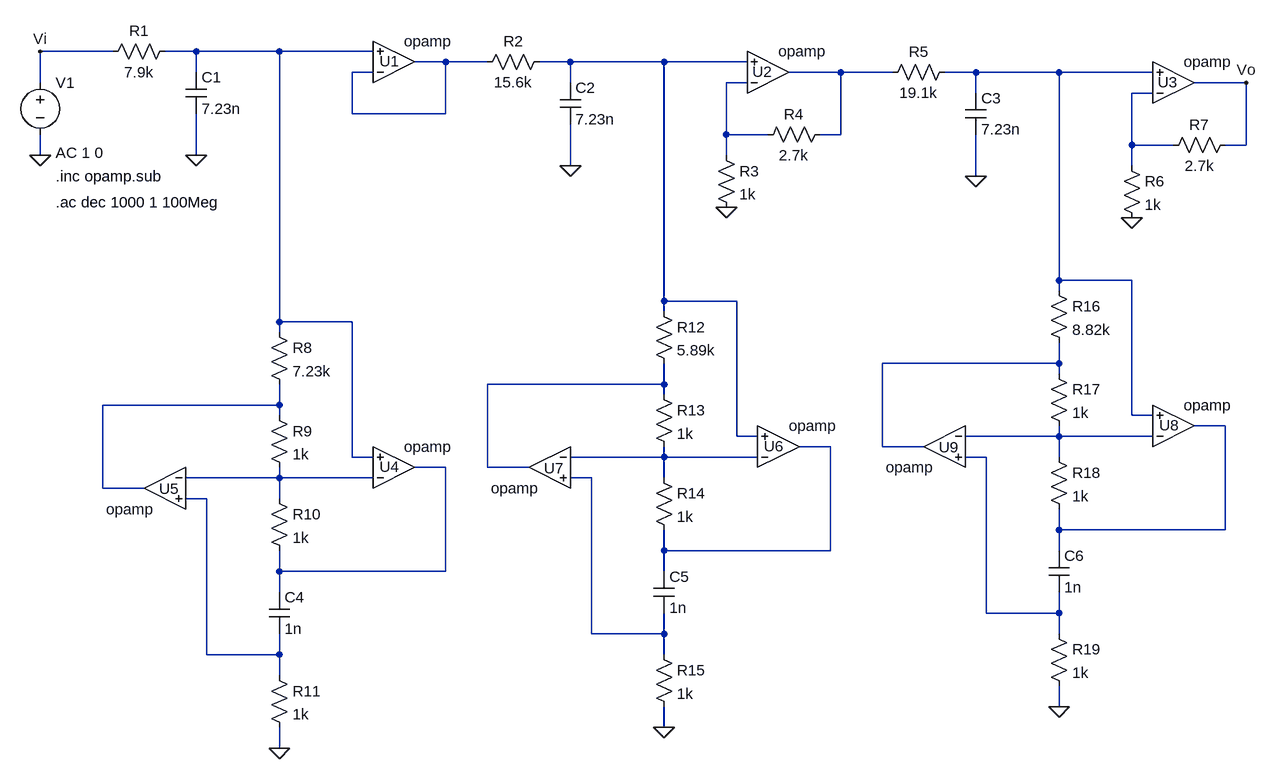
[diagram p0: schematic Circuito2.asc]
Circuito2.asc, the LTspice schematic file:
Version 4
SHEET 1 1728 1188
WIRE -48 80 -160 80
WIRE 80 80 32 80
WIRE 208 80 80 80
WIRE 352 80 208 80
WIRE 464 96 416 96
WIRE 528 96 464 96
WIRE 656 96 608 96
WIRE 800 96 656 96
WIRE 928 96 800 96
WIRE 80 112 80 80
WIRE 352 112 320 112
WIRE 1072 112 992 112
WIRE 1152 112 1072 112
WIRE 1280 112 1232 112
WIRE 1408 112 1280 112
WIRE 1552 112 1408 112
WIRE -160 128 -160 80
WIRE 656 128 656 96
WIRE 928 128 896 128
WIRE 1696 128 1616 128
WIRE 1280 144 1280 112
WIRE 1552 144 1520 144
WIRE 320 176 320 112
WIRE 464 176 464 96
WIRE 464 176 320 176
WIRE 896 208 896 128
WIRE 960 208 896 208
WIRE 1072 208 1072 112
WIRE 1072 208 1040 208
WIRE 1520 224 1520 144
WIRE 1584 224 1520 224
WIRE 1696 224 1696 128
WIRE 1696 224 1664 224
WIRE -160 240 -160 208
WIRE 80 240 80 176
WIRE 896 240 896 208
WIRE 656 256 656 192
WIRE 1520 256 1520 224
WIRE 1280 272 1280 208
WIRE 1408 432 1408 112
WIRE 1520 432 1408 432
WIRE 1408 448 1408 432
WIRE 800 464 800 96
WIRE 912 464 800 464
WIRE 800 480 800 464
WIRE 208 496 208 80
WIRE 320 496 208 496
WIRE 208 512 208 496
WIRE 1408 560 1408 528
WIRE 1408 560 1136 560
WIRE 1408 576 1408 560
WIRE 800 592 800 560
WIRE 800 592 528 592
WIRE 800 608 800 592
WIRE 208 624 208 592
WIRE 208 624 -64 624
WIRE 208 640 208 624
WIRE 1520 640 1520 432
WIRE 1552 640 1520 640
WIRE 1664 656 1616 656
WIRE 912 672 912 464
WIRE 944 672 912 672
WIRE 1408 672 1408 656
WIRE 1408 672 1264 672
WIRE 1552 672 1408 672
WIRE 1056 688 1008 688
WIRE 1136 688 1136 560
WIRE 1200 688 1136 688
WIRE 320 704 320 496
WIRE 352 704 320 704
WIRE 800 704 800 688
WIRE 800 704 656 704
WIRE 944 704 800 704
WIRE 1296 704 1264 704
WIRE 1408 704 1408 672
WIRE 464 720 416 720
WIRE 528 720 528 592
WIRE 592 720 528 720
WIRE 208 736 208 720
WIRE 208 736 64 736
WIRE 352 736 208 736
WIRE 688 736 656 736
WIRE 800 736 800 704
WIRE -64 752 -64 624
WIRE 0 752 -64 752
WIRE 96 768 64 768
WIRE 208 768 208 736
WIRE 1408 816 1408 784
WIRE 1664 816 1664 656
WIRE 1664 816 1408 816
WIRE 800 848 800 816
WIRE 1056 848 1056 688
WIRE 1056 848 800 848
WIRE 1408 848 1408 816
WIRE 208 880 208 848
WIRE 464 880 464 720
WIRE 464 880 208 880
WIRE 800 880 800 848
WIRE 208 912 208 880
WIRE 1296 944 1296 704
WIRE 1408 944 1408 912
WIRE 1408 944 1296 944
WIRE 688 976 688 736
WIRE 800 976 800 944
WIRE 800 976 688 976
WIRE 1408 976 1408 944
WIRE 96 1008 96 768
WIRE 208 1008 208 976
WIRE 208 1008 96 1008
WIRE 800 1008 800 976
WIRE 208 1040 208 1008
WIRE 1408 1088 1408 1056
WIRE 800 1120 800 1088
WIRE 208 1152 208 1120
FLAG 80 240 0
FLAG 656 256 0
FLAG 896 320 0
FLAG 1280 272 0
FLAG 1520 336 0
FLAG 1696 128 Vo
FLAG -160 240 0
FLAG -160 80 Vi
FLAG 208 1152 0
FLAG 800 1120 0
FLAG 1408 1088 0
SYMBOL cap 64 112 R0
SYMATTR InstName C1
SYMATTR Value 7.23n
SYMBOL res 48 64 R90
WINDOW 0 0 56 VBottom 2
WINDOW 3 32 56 VTop 2
SYMATTR InstName R1
SYMATTR Value 7.9k
SYMBOL OpAmps\\opamp 384 160 M180
WINDOW 0 -22 65 Left 2
SYMATTR InstName U1
SYMBOL cap 640 128 R0
SYMATTR InstName C2
SYMATTR Value 7.23n
SYMBOL res 624 80 R90
WINDOW 0 0 56 VBottom 2
WINDOW 3 32 56 VTop 2
SYMATTR InstName R2
SYMATTR Value 15.6k
SYMBOL OpAmps\\opamp 960 176 M180
WINDOW 0 -24 65 Left 2
SYMATTR InstName U2
SYMBOL res 880 224 R0
SYMATTR InstName R3
SYMATTR Value 1k
SYMBOL res 1056 192 R90
WINDOW 0 0 56 VBottom 2
WINDOW 3 32 56 VTop 2
SYMATTR InstName R4
SYMATTR Value 2.7k
SYMBOL cap 1264 144 R0
SYMATTR InstName C3
SYMATTR Value 7.23n
SYMBOL res 1248 96 R90
WINDOW 0 0 56 VBottom 2
WINDOW 3 32 56 VTop 2
SYMATTR InstName R5
SYMATTR Value 19.1k
SYMBOL OpAmps\\opamp 1584 192 M180
WINDOW 0 -24 65 Left 2
SYMATTR InstName U3
SYMBOL res 1504 240 R0
SYMATTR InstName R6
SYMATTR Value 1k
SYMBOL res 1680 208 R90
WINDOW 0 0 56 VBottom 2
WINDOW 3 32 56 VTop 2
SYMATTR InstName R7
SYMATTR Value 2.7k
SYMBOL voltage -160 112 R0
WINDOW 123 24 124 Left 2
WINDOW 39 0 0 Left 0
SYMATTR Value2 AC 1 0
SYMATTR InstName V1
SYMATTR Value ""
SYMBOL res 192 496 R0
SYMATTR InstName R8
SYMATTR Value 7.23k
SYMBOL res 192 624 R0
SYMATTR InstName R9
SYMATTR Value 1k
SYMBOL res 192 752 R0
SYMATTR InstName R10
SYMATTR Value 1k
SYMBOL cap 192 912 R0
SYMATTR InstName C4
SYMATTR Value 1n
SYMBOL res 192 1024 R0
SYMATTR InstName R11
SYMATTR Value 1k
SYMBOL OpAmps\\opamp 384 784 M180
WINDOW 0 -22 65 Left 2
SYMATTR InstName U4
SYMBOL OpAmps\\opamp 32 688 M0
WINDOW 0 -22 65 Left 2
SYMATTR InstName U5
SYMBOL res 784 464 R0
SYMATTR InstName R12
SYMATTR Value 5.89k
SYMBOL res 784 592 R0
SYMATTR InstName R13
SYMATTR Value 1k
SYMBOL res 784 720 R0
SYMATTR InstName R14
SYMATTR Value 1k
SYMBOL cap 784 880 R0
SYMATTR InstName C5
SYMATTR Value 1n
SYMBOL res 784 992 R0
SYMATTR InstName R15
SYMATTR Value 1k
SYMBOL OpAmps\\opamp 976 752 M180
WINDOW 0 -22 65 Left 2
SYMATTR InstName U6
SYMBOL OpAmps\\opamp 624 656 M0
WINDOW 0 -22 65 Left 2
SYMATTR InstName U7
SYMBOL res 1392 432 R0
SYMATTR InstName R16
SYMATTR Value 8.82k
SYMBOL res 1392 560 R0
SYMATTR InstName R17
SYMATTR Value 1k
SYMBOL res 1392 688 R0
SYMATTR InstName R18
SYMATTR Value 1k
SYMBOL cap 1392 848 R0
SYMATTR InstName C6
SYMATTR Value 1n
SYMBOL res 1392 960 R0
SYMATTR InstName R19
SYMATTR Value 1k
SYMBOL OpAmps\\opamp 1584 720 M180
WINDOW 0 -22 65 Left 2
SYMATTR InstName U8
SYMBOL OpAmps\\opamp 1232 624 M0
WINDOW 0 -22 65 Left 2
SYMATTR InstName U9
TEXT -136 272 Left 2 !.inc opamp.sub
TEXT -136 312 Left 2 !.ac dec 1000 1 100Meg

The netlist it stands for:
* Circuito2.asc
C1 N001 0 7.23n
R1 N001 Vi 7.9k
XU1 N002 N001 N002 opamp Aol=100K GBW=10Meg  ; pins invin noninvin out
C2 N003 0 7.23n
R2 N003 N002 15.6k
XU2 N006 N003 N004 opamp Aol=100K GBW=10Meg  ; pins invin noninvin out
R3 N006 0 1k
R4 N004 N006 2.7k
C3 N005 0 7.23n
R5 N005 N004 19.1k
XU3 N007 N005 Vo opamp Aol=100K GBW=10Meg  ; pins invin noninvin out
R6 N007 0 1k
R7 Vo N007 2.7k
V1 Vi 0 AC 1 0
R8 N001 N010 7.23k
R9 N010 N017 1k
R10 N017 N016 1k
C4 N016 N019 1n
R11 N019 0 1k
XU4 N017 N001 N016 opamp Aol=100K GBW=10Meg  ; pins invin noninvin out
XU5 N017 N019 N010 opamp Aol=100K GBW=10Meg  ; pins invin noninvin out
R12 N003 N009 5.89k
R13 N009 N014 1k
R14 N014 N013 1k
C5 N013 N018 1n
R15 N018 0 1k
XU6 N014 N003 N013 opamp Aol=100K GBW=10Meg  ; pins invin noninvin out
XU7 N014 N018 N009 opamp Aol=100K GBW=10Meg  ; pins invin noninvin out
R16 N005 N008 8.82k
R17 N008 N012 1k
R18 N012 N011 1k
C6 N011 N015 1n
R19 N015 0 1k
XU8 N012 N005 N011 opamp Aol=100K GBW=10Meg  ; pins invin noninvin out
XU9 N012 N015 N008 opamp Aol=100K GBW=10Meg  ; pins invin noninvin out
.inc opamp.sub
.ac dec 1000 1 100Meg
.backanno
.end